# EasyEDA schematic SCH_I2C Divider_2021-08-28.json
TITLE: Sheet_1; REV: 1.0; Date: 2021-08-09; Sheet: 1/1; Drawn By: amd940; Company: amd940
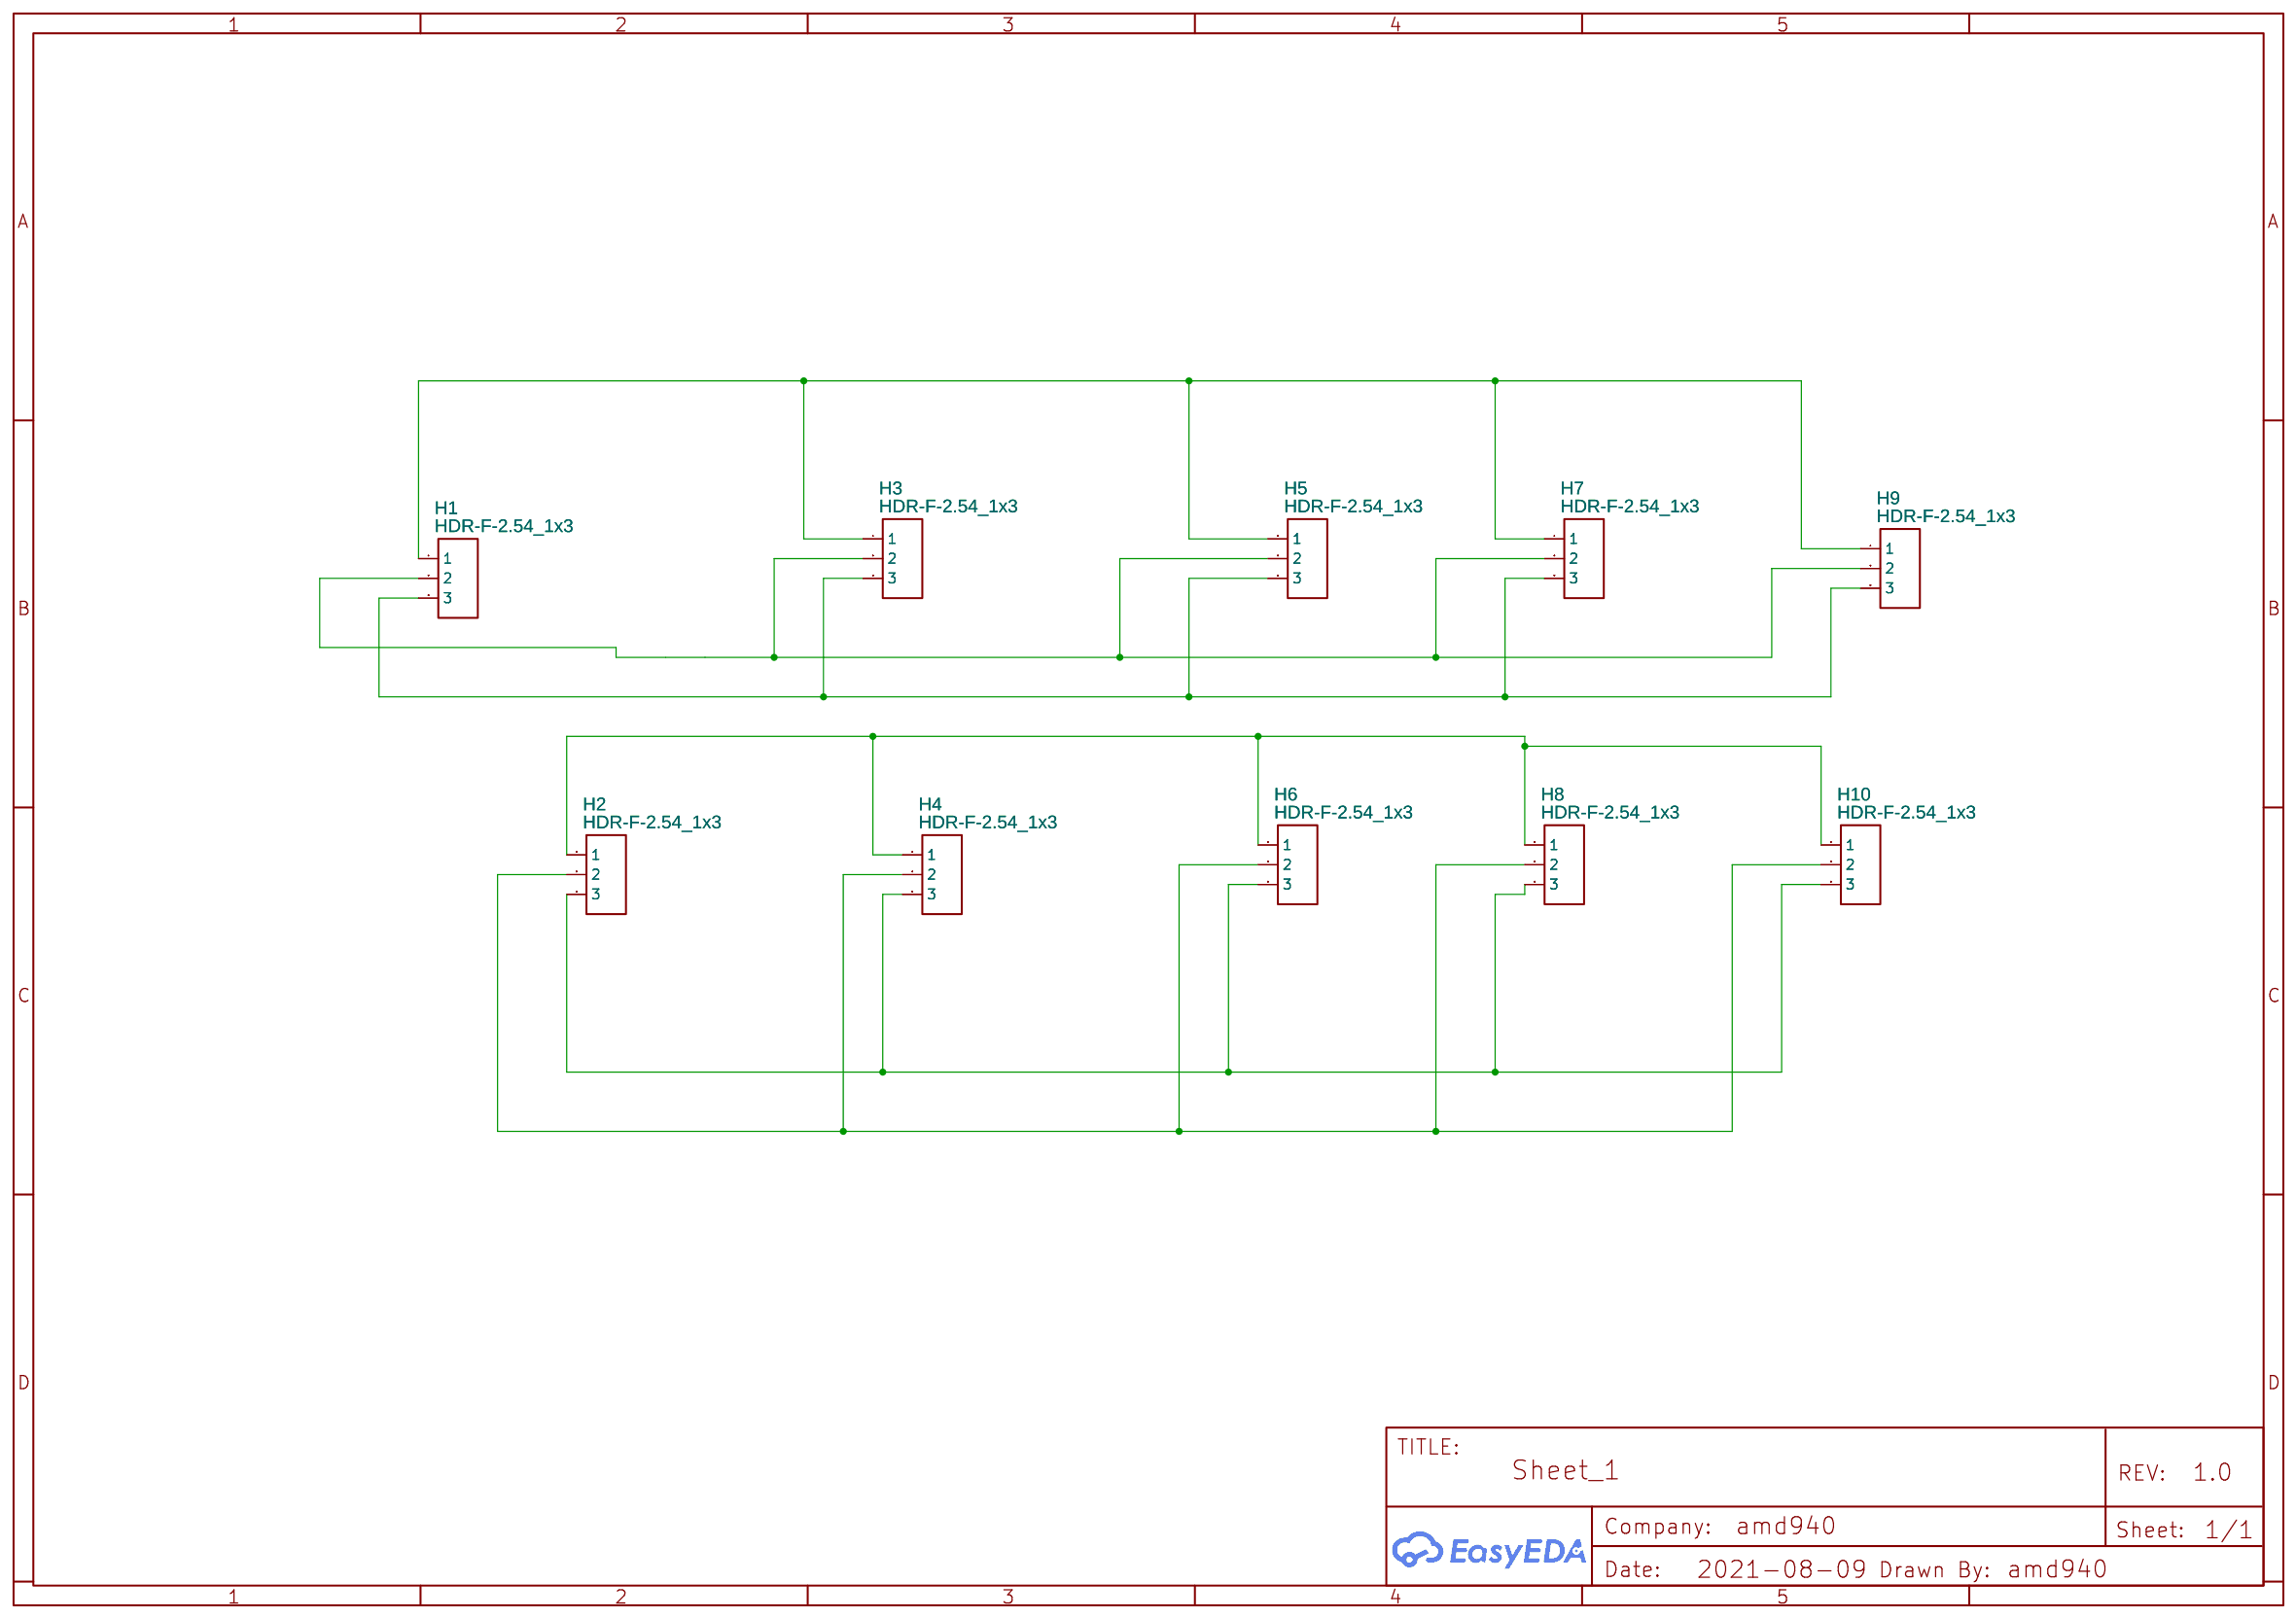
[diagram p0: schematic sheet]

## Parts
H1  HDR-F-2.54_1x3  [HDR-F-2.54_1X3]
H2  HDR-F-2.54_1x3  [HDR-F-2.54_1X3]
H3  HDR-F-2.54_1x3  [HDR-F-2.54_1X3]
H4  HDR-F-2.54_1x3  [HDR-F-2.54_1X3]
H5  HDR-F-2.54_1x3  [HDR-F-2.54_1X3]
H6  HDR-F-2.54_1x3  [HDR-F-2.54_1X3]
H7  HDR-F-2.54_1x3  [HDR-F-2.54_1X3]
H8  HDR-F-2.54_1x3  [HDR-F-2.54_1X3]
H9  HDR-F-2.54_1x3  [HDR-F-2.54_1X3]
H10  HDR-F-2.54_1x3  [HDR-F-2.54_1X3]

## Library data of the parts
H1-H10 = HDR-F-2.54_1x3: Supplier Part: C146690; Supplier: LCSC; Contributor: LCEDA_Lib

## Nets
Net-(H1-1): H1.1 H3.1 H5.1 H7.1 H9.1
Net-(H1-2): H1.2 H3.2 H5.2 H7.2 H9.2
Net-(H1-3): H1.3 H3.3 H5.3 H7.3 H9.3
Net-(H2-1): H2.1 H4.1 H6.1 H8.1 H10.1
Net-(H2-2): H2.2 H4.2 H6.2 H8.2 H10.2
Net-(H2-3): H2.3 H4.3 H6.3 H8.3 H10.3
